# EAGLE design tick-display-mk-5.1 (EAGLE 6.5.0)
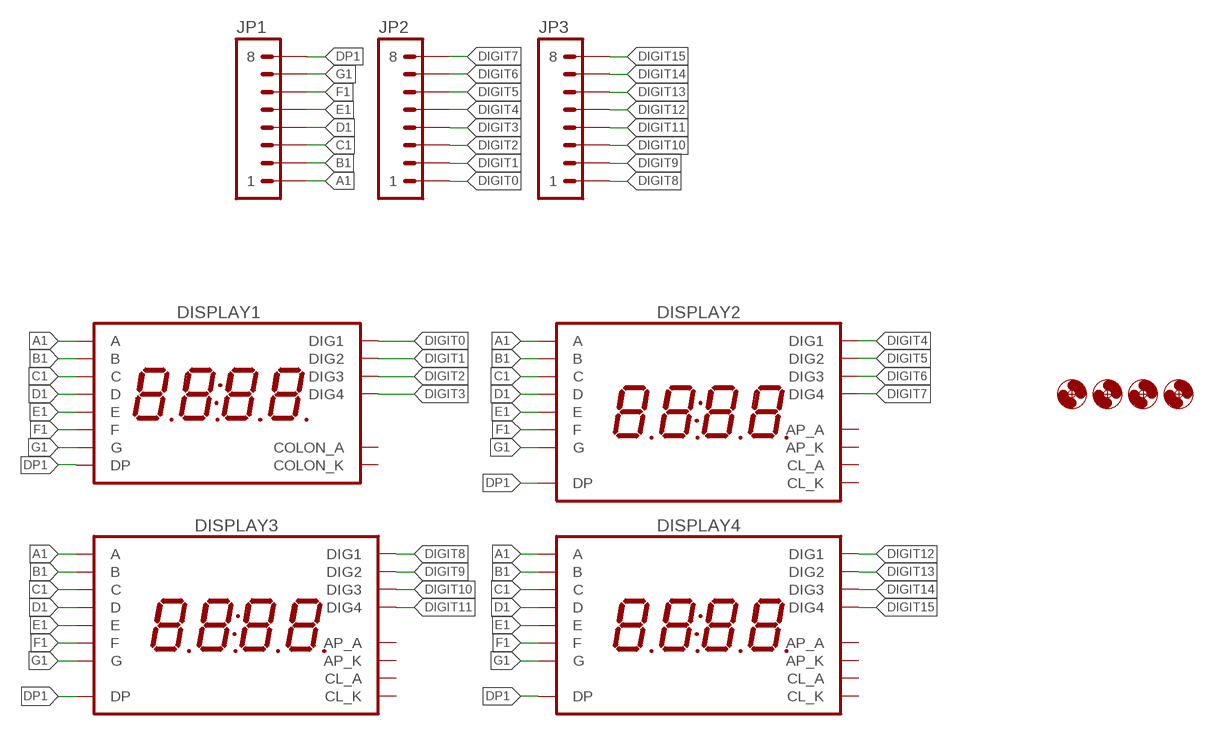
[diagram p0: schematic, sheet 1]

## Parts
DISPLAY1  7SEG_4DIGIT_COLON14.2MM-CC  [7SEG_4DIG_0.56IN_14MM_ADAFRUIT]
DISPLAY2  7SEG_4DIGIT_COLON_APOS  [7SEG_4DIG_10MM]
DISPLAY3  7SEG_4DIGIT_COLON_APOS  [7SEG_4DIG_10MM]
DISPLAY4  7SEG_4DIGIT_COLON_APOS  [7SEG_4DIG_10MM]
H1  HOLE#2  [HOLE-#2]
H2  HOLE#2  [HOLE-#2]
H3  HOLE#2  [HOLE-#2]
H4  HOLE#2  [HOLE-#2]
JP1  M081X08  [1X08]
JP2  M081X08  [1X08]
JP3  M081X08  [1X08]

## Nets
A1: DISPLAY1.P$13(A) DISPLAY2.14(A) DISPLAY3.14(A) DISPLAY4.14(A) JP1.1
B1: DISPLAY1.P$9(B) DISPLAY2.16(B) DISPLAY3.16(B) DISPLAY4.16(B) JP1.2
C1: DISPLAY1.P$4(C) DISPLAY2.13(C) DISPLAY3.13(C) DISPLAY4.13(C) JP1.3
D1: DISPLAY1.P$2(D) DISPLAY2.3(D) DISPLAY3.3(D) DISPLAY4.3(D) JP1.4
DIGIT0: DISPLAY1.P$14(DIG1) JP2.1
DIGIT1: DISPLAY1.P$11(DIG2) JP2.2
DIGIT2: DISPLAY1.P$10(DIG3) JP2.3
DIGIT3: DISPLAY1.P$6(DIG4) JP2.4
DIGIT4: DISPLAY2.1(DIG1) JP2.5
DIGIT5: DISPLAY2.2(DIG2) JP2.6
DIGIT6: DISPLAY2.6(DIG3) JP2.7
DIGIT7: DISPLAY2.8(DIG4) JP2.8
DIGIT8: DISPLAY3.1(DIG1) JP3.1
DIGIT9: DISPLAY3.2(DIG2) JP3.2
DIGIT10: DISPLAY3.6(DIG3) JP3.3
DIGIT11: DISPLAY3.8(DIG4) JP3.4
DIGIT12: DISPLAY4.1(DIG1) JP3.5
DIGIT13: DISPLAY4.2(DIG2) JP3.6
DIGIT14: DISPLAY4.6(DIG3) JP3.7
DIGIT15: DISPLAY4.8(DIG4) JP3.8
DP1: DISPLAY1.P$3(DP) DISPLAY2.7(DP) DISPLAY3.7(DP) DISPLAY4.7(DP) JP1.8
E1: DISPLAY1.P$1(E) DISPLAY2.5(E) DISPLAY3.5(E) DISPLAY4.5(E) JP1.5
F1: DISPLAY1.P$12(F) DISPLAY2.11(F) DISPLAY3.11(F) DISPLAY4.11(F) JP1.6
G1: DISPLAY1.P$5(G) DISPLAY2.15(G) DISPLAY3.15(G) DISPLAY4.15(G) JP1.7
Unconnected: DISPLAY1.P$7(COLON_K) DISPLAY1.P$8(COLON_A) DISPLAY2.4(CL_A) DISPLAY2.9(AP_K) DISPLAY2.10(AP_A) DISPLAY2.12(CL_K) DISPLAY3.4(CL_A) DISPLAY3.9(AP_K) DISPLAY3.10(AP_A) DISPLAY3.12(CL_K) DISPLAY4.4(CL_A) DISPLAY4.9(AP_K) DISPLAY4.10(AP_A) DISPLAY4.12(CL_K)

## Library data of the parts
DISPLAY1 = A_butts:7SEG_4DIGIT_COLON
DISPLAY2-DISPLAY4 = A_butts:7SEG_4DIGIT_COLON_APOS
H1-H4 = A_butts:HOLE: MOUNTING HOLE with drill center marker
JP1-JP3 = A_butts:M08: Header 8 Standard 8-pin 0.1" header. Use with straight break away headers (SKU : PRT-00116), right angle break away headers (PRT-00553), swiss pins (PRT-00743), machine pins (PRT-00117), and female headers (PRT-00115).

## Board
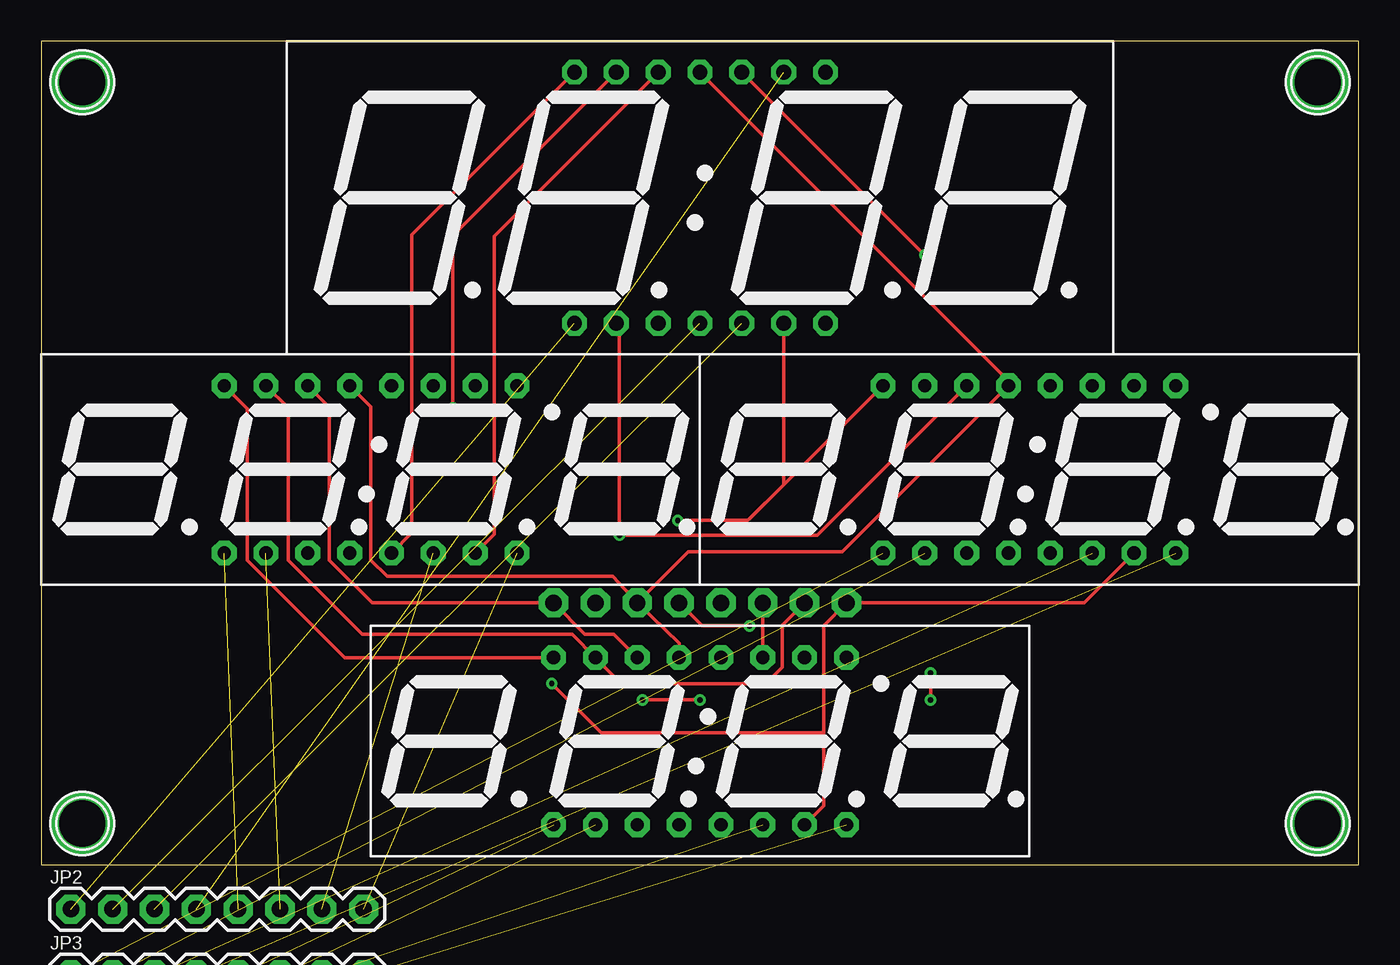
[diagram p1: board, top side]
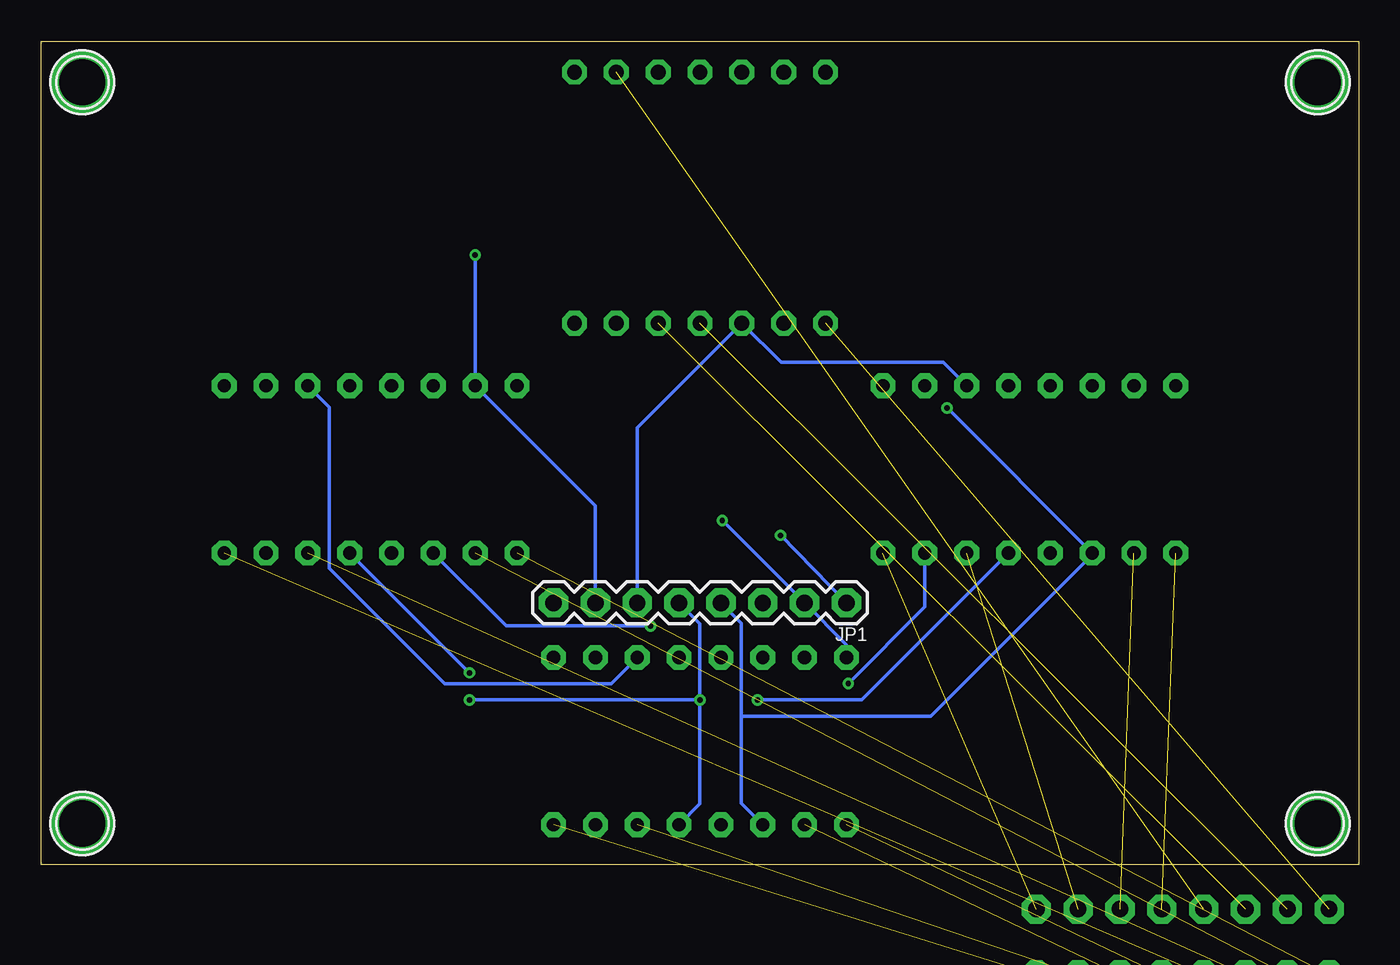
[diagram p2: board, bottom side, seen from below]

Size 80 x 50 mm. Coordinates in mm from the lower left corner, seen from the top.
Outline: 80,0 80,50 0,50 0,0 80,0
Copper layers (1*16): Top 0.0356mm / dielectric 1.5011mm / Bottom 0.0356mm
Design rules "LaenPCBOrder2": minimum track width 6mil, minimum drill 13mil, track to track 6mil, track to pad 6mil, pad to pad 6mil, via to via 6mil, smd to smd 6mil, copper to edge 15mil, drill to drill 6mil, minimum pad ring 7mil, minimum via ring 7mil, stop-mask expansion 3mil, vias tented up to drill 20mil, thermal gap 10mil

### Footprints (pad centres in the part's own frame; a part is rotated, then mirrored left to right if it is on the bottom)
7SEG_4DIG_0.56IN_14MM_ADAFRUIT = drill 0.9 pad 1.5 octagon: P$1 -7.62,7.62; P$2 -5.08,7.62; P$3 -2.54,7.62; P$4 0,7.62; P$5 2.54,7.62; P$6 5.08,7.62; P$7 7.62,7.62; P$8 7.62,-7.62; P$9 5.08,-7.62; P$10 2.54,-7.62; P$11 0,-7.62; P$12 -2.54,-7.62; P$13 -5.08,-7.62; P$14 -7.62,-7.62
7SEG_4DIG_10MM = drill 0.8 pad 1.5 octagon: 1 -8.89,-5.08; 2 -6.35,-5.08; 3 -3.81,-5.08; 4 -1.27,-5.08; 5 1.27,-5.08; 6 3.81,-5.08; 7 6.35,-5.08; 8 8.89,-5.08; 9 8.89,5.08; 10 6.35,5.08; 11 3.81,5.08; 12 1.27,5.08; 13 -1.27,5.08; 14 -3.81,5.08; 15 -6.35,5.08; 16 -8.89,5.08
HOLE-#2 = drill 2.8 pad 3.81: P$1 0,0
1X08 = drill 1 pad 1.778 octagon: 1 0,0; 2 2.54,0; 3 5.08,0; 4 7.62,0; 5 10.16,0; 6 12.7,0; 7 15.24,0; 8 17.78,0

### Placement (x,y rotation side)
DISPLAY1  40,40.5 0 top
DISPLAY2  20,24 0 top
DISPLAY3  60,24 0 top
DISPLAY4  40,7.5 0 top
H1  2.5,2.5 0 top
H2  2.5,47.5 0 top
H3  77.5,2.5 0 top
H4  77.5,47.5 0 top
JP1  31.11,15.9 180 bottom
JP2  1.8,-2.7 0 top
JP3  1.8,-6.7 0 top  (outside the outline)

### Tracks (layer width: path | path; a pad name or v marks a point on that pad's centre or on a via)
A1  (via drill 0.33)
  Top 0.2: DISPLAY4.14 34.77,14 33.01,14 JP1.1 20.1,15.9 17.5,18.5 17.5,27.77 DISPLAY2.14 | DISPLAY3.14 47.11,20 v35.11,20 35.11,32.69 DISPLAY1.P$13
  Bottom 0.2: v35.11,20 JP1.1
B1  (via drill 0.33)
  Top 0.2: DISPLAY4.16 18.42,12.58 12.5,18.5 12.5,27.69 DISPLAY2.16 | DISPLAY3.16 43.03,21 42.9,20.9 | 42.9,20.9 v38.65,20.9 | DISPLAY1.P$9 45.08,23.08 42.9,20.9
  Bottom 0.2: DISPLAY4.16 31.11,13.36 JP1.2 v38.65,20.9
C1
  Top 0.2: JP1.3 38.73,13.46 DISPLAY4.13 | DISPLAY2.13 20,27.81 20,18.5 21,17.5 34.69,17.5 JP1.3 | JP1.3 39.29,19 48.65,19 DISPLAY3.13 58.73,29.39 DISPLAY1.P$4
D1  (via drill 0.33)
  Top 0.2: v43,14.5 40.13,14.5 JP1.4 | DISPLAY1.P$2 25,38.2 v25,27.73
  Bottom 0.2: 37.5,9 37.5,14.67 JP1.4 | 37.5,9 37.5,3.73 DISPLAY4.3 | 37.5,9 26,9 16.19,18.81 DISPLAY2.3 v25,27.73 | DISPLAY3.3 51.77,14.5 v43,14.5
DIGIT0  (1 unrouted)
DIGIT1  (1 unrouted)
DIGIT2  (1 unrouted)
DIGIT3  (1 unrouted)
DIGIT4  (1 unrouted)
DIGIT5  (1 unrouted)
DIGIT6  (1 unrouted)
DIGIT7  (1 unrouted)
DIGIT8  (1 unrouted)
DIGIT9  (1 unrouted)
DIGIT10  (1 unrouted)
DIGIT11  (1 unrouted)
DIGIT12  (1 unrouted)
DIGIT13  (1 unrouted)
DIGIT14  (1 unrouted)
DIGIT15  (1 unrouted)
DP1  (via drill 0.33)
  Top 0.2: 47.5,8 47.5,14.51 JP1.8 63.33,15.9 DISPLAY3.7 | 47.5,8 47.5,3.57 DISPLAY4.7 | v31,11 34,8 47.5,8 | DISPLAY1.P$3 27.5,38.16 27.5,20.07 DISPLAY2.7
  Bottom 0.2: DISPLAY2.7 26.35,15.65 v31,11
E1  (via drill 0.33)
  Top 0.2: v36.5,10 v40,10 | v54,11.65 v54,10 | DISPLAY1.P$1 22.5,38.24 22.5,20.15 DISPLAY2.5
  Bottom 0.2: v40,10 40,14.63 JP1.5 | v40,10 40,3.69 DISPLAY4.5 | DISPLAY2.5 30.19,10 v36.5,10 | DISPLAY3.5 v54,11.65 | v54,10 v40,10
F1
  Top 0.2: JP1.6 DISPLAY4.11
  Bottom 0.2: DISPLAY3.11 62.5,27.77 62.5,18 55.5,11 45.39,11 DISPLAY4.11 | JP1.6 43.81,26.53 DISPLAY1.P$12 35.08,30.5 25.23,30.5 DISPLAY2.11
G1  (via drill 0.33)
  Top 0.2: DISPLAY2.15 15,27.73 15,18.5 19.5,14 32.23,14 DISPLAY4.15 35.23,11 44,11 45,12 45,14.55 JP1.7 | DISPLAY1.P$5 v53.65,37.01
  Bottom 0.2: JP1.7 46.35,21.78 DISPLAY3.15 v53.65,37.01